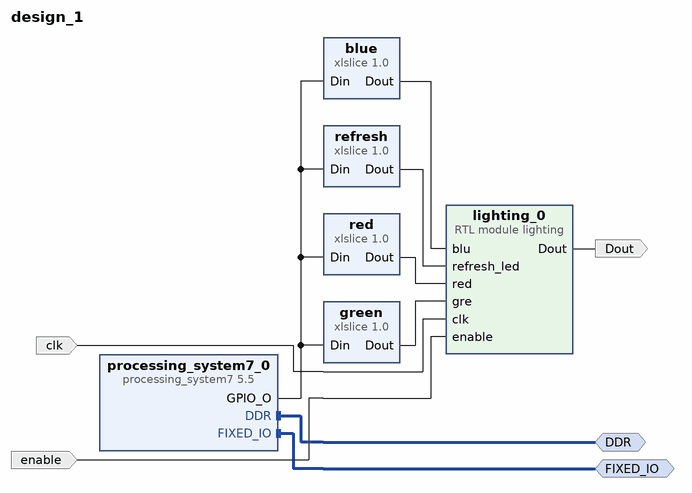
[diagram p0: block diagram of the top level]
# Vivado block design design_1, xc7z020clg400-1, Vivado 2022.1
create_bd_design design_1

create_bd_intf_port -mode Master -vlnv xilinx.com:interface:ddrx_rtl:1.0 DDR
create_bd_intf_port -mode Master -vlnv xilinx.com:display_processing_system7:fixedio_rtl:1.0 FIXED_IO
create_bd_port -dir I enable
create_bd_port -dir O Dout
create_bd_port -dir I -type clk clk
set_property -dict {CONFIG.FREQ_HZ 125000000} [get_bd_ports clk]

create_bd_cell -type ip -vlnv xilinx.com:ip:processing_system7:5.5 processing_system7_0
set_property -dict [list \
  CONFIG.PCW_APU_PERIPHERAL_FREQMHZ 650 \
  CONFIG.PCW_CRYSTAL_PERIPHERAL_FREQMHZ 50 \
  CONFIG.PCW_ENET0_PERIPHERAL_ENABLE 0 \
  CONFIG.PCW_FPGA0_PERIPHERAL_FREQMHZ 100 \
  CONFIG.PCW_FPGA1_PERIPHERAL_FREQMHZ 50 \
  CONFIG.PCW_GPIO_EMIO_GPIO_ENABLE 1 \
  CONFIG.PCW_GPIO_EMIO_GPIO_IO 25 \
  CONFIG.PCW_GPIO_EMIO_GPIO_WIDTH 25 \
  CONFIG.PCW_GPIO_MIO_GPIO_ENABLE 0 \
  CONFIG.PCW_PERIPHERAL_BOARD_PRESET part0 \
  CONFIG.PCW_PRESET_BANK1_VOLTAGE {LVCMOS 1.8V} \
  CONFIG.PCW_QSPI_GRP_FBCLK_ENABLE 1 \
  CONFIG.PCW_QSPI_GRP_FBCLK_IO {MIO 8} \
  CONFIG.PCW_QSPI_GRP_SINGLE_SS_ENABLE 1 \
  CONFIG.PCW_QSPI_GRP_SINGLE_SS_IO {MIO 1 .. 6} \
  CONFIG.PCW_QSPI_PERIPHERAL_ENABLE 1 \
  CONFIG.PCW_QSPI_QSPI_IO {MIO 1 .. 6} \
  CONFIG.PCW_SD0_PERIPHERAL_ENABLE 0 \
  CONFIG.PCW_SINGLE_QSPI_DATA_MODE x4 \
  CONFIG.PCW_UART1_PERIPHERAL_ENABLE 0 \
  CONFIG.PCW_UIPARAM_DDR_BUS_WIDTH {16 Bit} \
  CONFIG.PCW_UIPARAM_DDR_FREQ_MHZ 525 \
  CONFIG.PCW_UIPARAM_DDR_PARTNO {MT41J256M16 RE-125} \
  CONFIG.PCW_USB0_PERIPHERAL_ENABLE 0 \
  CONFIG.PCW_USE_M_AXI_GP0 0 \
  CONFIG.preset None \
] [get_bd_cells processing_system7_0]
# 338 more settings of processing_system7_0 are not shown: defaults, MIO pin electricals, DDR timing, and values the tool derives
create_bd_cell -type ip -vlnv xilinx.com:ip:xlslice:1.0 red
set_property -dict {CONFIG.DIN_FROM 7 CONFIG.DIN_TO 0 CONFIG.DIN_WIDTH 25 CONFIG.DOUT_WIDTH 8} [get_bd_cells red]
create_bd_cell -type ip -vlnv xilinx.com:ip:xlslice:1.0 green
set_property -dict {CONFIG.DIN_FROM 23 CONFIG.DIN_TO 16 CONFIG.DIN_WIDTH 25 CONFIG.DOUT_WIDTH 8} [get_bd_cells green]
create_bd_cell -type ip -vlnv xilinx.com:ip:xlslice:1.0 blue
set_property -dict {CONFIG.DIN_FROM 15 CONFIG.DIN_TO 8 CONFIG.DIN_WIDTH 25 CONFIG.DOUT_WIDTH 8} [get_bd_cells blue]
create_bd_cell -type ip -vlnv xilinx.com:ip:xlslice:1.0 refresh
set_property -dict {CONFIG.DIN_FROM 24 CONFIG.DIN_TO 24 CONFIG.DIN_WIDTH 25 CONFIG.DOUT_WIDTH 1} [get_bd_cells refresh]
create_bd_cell -type module -reference lighting lighting_0

# ---- connections ----

connect_bd_intf_net [get_bd_intf_ports DDR] [get_bd_intf_pins processing_system7_0/DDR]
connect_bd_intf_net [get_bd_intf_ports FIXED_IO] [get_bd_intf_pins processing_system7_0/FIXED_IO]
connect_bd_net [get_bd_pins blue/Dout] [get_bd_pins lighting_0/blu]
connect_bd_net [get_bd_ports clk] [get_bd_pins lighting_0/clk]
connect_bd_net [get_bd_ports enable] [get_bd_pins lighting_0/enable]
connect_bd_net [get_bd_pins green/Dout] [get_bd_pins lighting_0/gre]
connect_bd_net [get_bd_pins lighting_0/Dout] [get_bd_ports Dout]
connect_bd_net [get_bd_pins processing_system7_0/GPIO_O] \
  [get_bd_pins red/Din] [get_bd_pins blue/Din] [get_bd_pins green/Din] [get_bd_pins refresh/Din]
connect_bd_net [get_bd_pins red/Dout] [get_bd_pins lighting_0/red]
connect_bd_net [get_bd_pins refresh/Dout] [get_bd_pins lighting_0/refresh_led]

validate_bd_design
save_bd_design
